# Altium schematic sheet switch.SchDoc
size A4
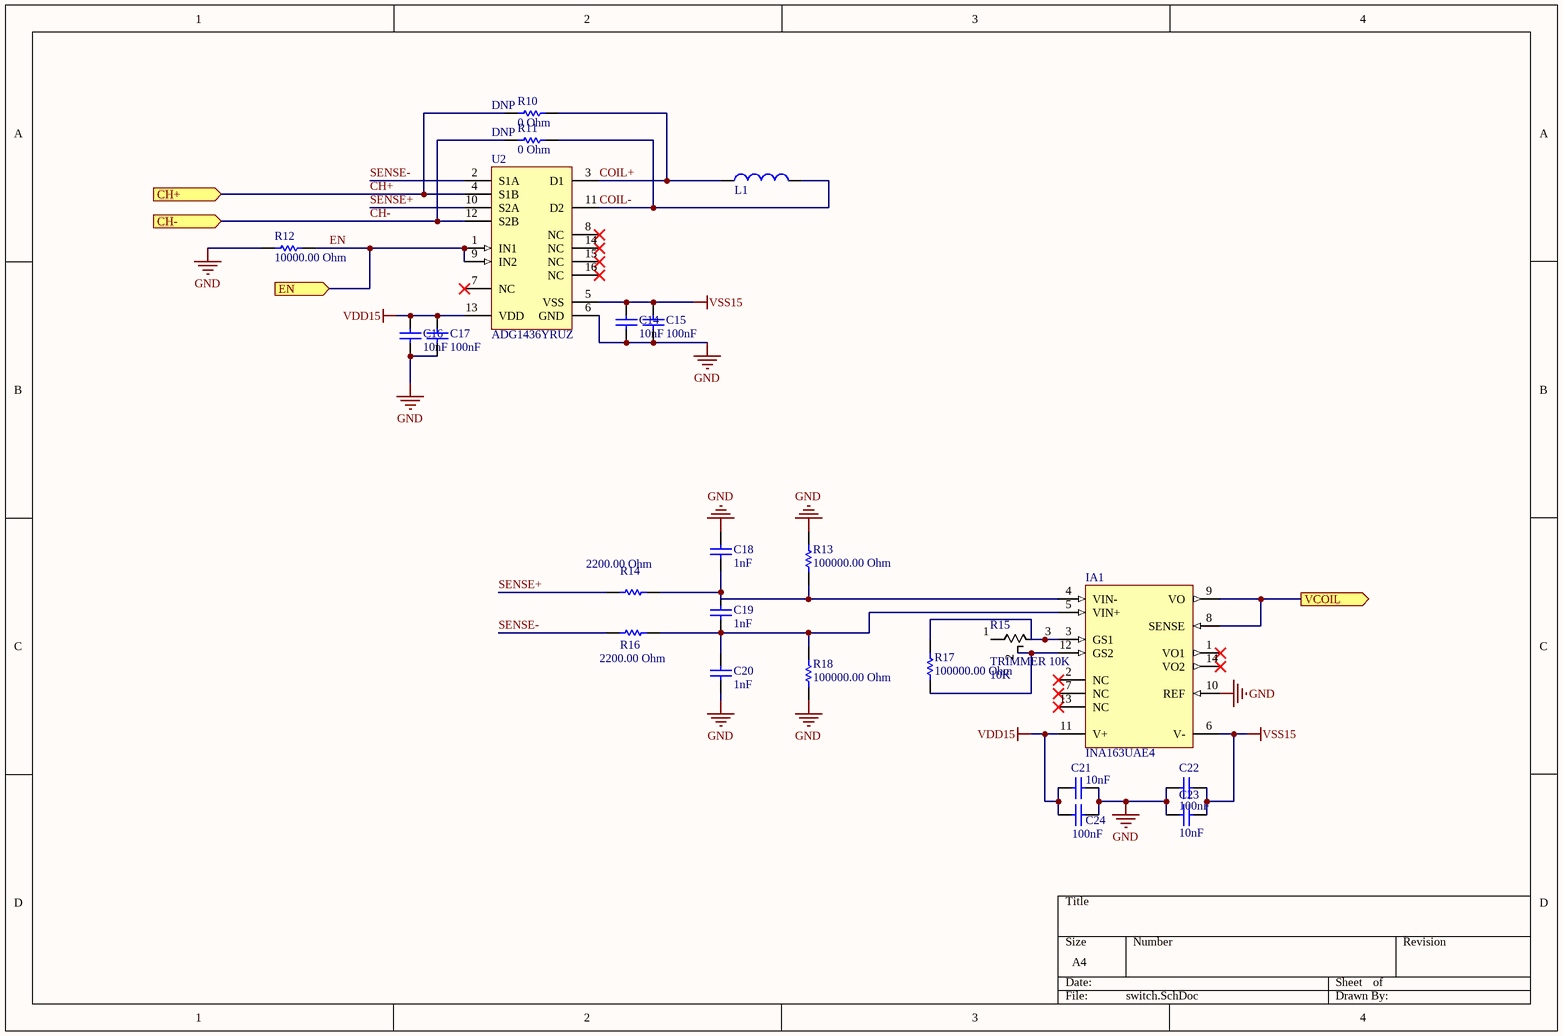
[diagram p0: switch.SchDoc]

## Parts
C14  value 10nF  [CAPC0603(1608)100_N]  (hidden comment: CAP 10nF 25V 0603(1608))
C15  value 100nF  [CAPC0603(1608)100_M]  (hidden comment: CAP 100nF 25V 0603(1608))
C16  value 10nF  [CAPC0603(1608)100_N]  (hidden comment: CAP 10nF 25V 0603(1608))
C17  value 100nF  [CAPC0603(1608)100_M]  (hidden comment: CAP 100nF 25V 0603(1608))
C18  value 1nF  [CAPC0603(1608)100_M]  (hidden comment: CAP 1nF 25V 0603(1608))
C19  value 1nF  [CAPC0603(1608)100_M]  (hidden comment: CAP 1nF 25V 0603(1608))
C20  value 1nF  [CAPC0603(1608)100_M]  (hidden comment: CAP 1nF 25V 0603(1608))
C21  value 10nF  [CAPC0603(1608)100_N]  (hidden comment: CAP 10nF 25V 0603(1608))
C22  value 100nF  [CAPC0603(1608)100_M]  (hidden comment: CAP 100nF 25V 0603(1608))
C23  value 10nF  [CAPC0603(1608)100_N]  (hidden comment: CAP 10nF 25V 0603(1608))
C24  value 100nF  [CAPC0603(1608)100_M]  (hidden comment: CAP 100nF 25V 0603(1608))
IA1  INA163UAE4  [TI-D14_M]
L1  (no value)  [TRANSMITTER_COIL_UCC_ORIGINAL]
R10  value 0 Ohm  [RESC0603(1608)_L]  (hidden comment: 1K 5% 0603(1608))
R11  value 0 Ohm  [RESC0603(1608)_L]  (hidden comment: 1K 5% 0603(1608))
R12  value 10000.00 Ohm  [RESC0603(1608)_L]  (hidden comment: 1K 5% 0603(1608))
R13  value 100000.00 Ohm  [RESC0603(1608)_N]  (hidden comment: 100K 5% 0603(1608))
R14  value 2200.00 Ohm  [RESC0603(1608)_L]  (hidden comment: 2K2 1% 0603(1608))
R15  TRIMMER 10K  value 10K  [TRIMMER 10K]
R16  value 2200.00 Ohm  [RESC0603(1608)_L]  (hidden comment: 2K2 1% 0603(1608))
R17  value 100000.00 Ohm  [RESC0603(1608)_N]  (hidden comment: 100K 5% 0603(1608))
R18  value 100000.00 Ohm  [RESC0603(1608)_N]  (hidden comment: 100K 5% 0603(1608))
U2  ADG1436YRUZ  [ADI-RU-16_L]

## Ports
CH+ (in), CH- (in), EN (in), VCOIL (out)

## Nets
GND: C14.1 C15.2 C16.1 C17.2 C18.2 C20.1 C21.2 C22.1 C23.2 C24.1 IA1.10(REF) R12.1 R13.1 R18.2 U2.6(GND)
VDD15: C16.2 C17.1 C21.1 C24.2 IA1.11(V+) U2.13(VDD)
VSS15: C14.2 C15.1 C22.2 C23.1 IA1.6(V-) U2.5(VSS)
CH+: R10.1 U2.4(S1B) ; port CH+
CH-: R11.1 U2.12(S2B) ; port CH-
COIL+: L1.2 R10.2 U2.3(D1)
COIL-: L1.1 R11.2 U2.11(D2)
EN: R12.2 U2.1(IN1) U2.9(IN2) ; port EN
SENSE+: R14.2 U2.10(S2A)
SENSE-: R16.2 U2.2(S1A)
VCOIL: IA1.8(SENSE) IA1.9(VO) ; port VCOIL
NetC18_1: C18.1 C19.2 IA1.4(VIN-) R13.2 R14.1
NetC19_1: C19.1 C20.2 IA1.5(VIN+) R16.1 R18.1
NetIA1_3: IA1.3(GS1) R15.3 R17.1
NetIA1_12: IA1.12(GS2) R15.2 R17.2

Not connected (* = marked no-connect by the designer): IA1 1(VO1)* 2(NC)* 7(NC)* 13(NC)* 14(VO2)*; R15 1; U2 7(NC)* 8(NC)* 14(NC)* 15(NC)* 16(NC)*

## Library data of the parts
C14 C16 C21 C23 = CMP-1035-02317-1: CAP 10nF 25V ±10% 0603 (1608 Metric) Thickness 1mm SMD; Tolerance: Â±10%; Case-Metric: 1608; Case-EIA: 0603; Max Thickness: 1 mm; Rated Voltage: 25 V; Technology: SMT; OrderURL: http://www.digikey.ie/product-detail/en/yageo/CC0603KRX7R8BB103/311-1360-1-ND/2103144; Supplier 1: Digi-Key; Supplier Part Number: 311-1360-1-ND; Supplier Part Number 1: 311-1360-1-ND
C15 C17 C22 C24 = CMP-1035-02588-1: CAP 100nF 25V ±10% 0603 (1608 Metric) Thickness 1mm SMD; Case-Metric: 1608; Case-EIA: 0603; Tolerance: Â±10%; Max Thickness: 1 mm; Technology: SMT; Rated Voltage: 25 V; OrderURL: http://www.digikey.ie/product-detail/en/yageo/CC0603KRX7R8BB104/311-1341-1-ND/2103125; Supplier 1: Digi-Key; Supplier Part Number 1: 311-1341-1-ND
C18-C20 = CMP-1035-01883-1: CAP 1nF 25V ±5% 0603 (1608 Metric) Thickness 1mm SMD; Case-EIA: 0603; Tolerance: Â±5%; Case-Metric: 1608; Technology: SMT; Rated Voltage: 25 V; Max Thickness: 1 mm
IA1 = CMP-0944-00014-1: Low-Noise Low-Distortion Instrumentation Amplifier, -40 to 125 degC, 14-pin SOIC (D14), Green (RoHS & no Sb/Br); Manufacturer: Texas Instruments; Non-Linearity (+/-)(Max)(%): 0.0006; Input Offset (+/-)(Max)(uV): 250; Vs(Max)(V): 36; Quiescent Current (+/-)(Typ)(mA): 10; Noise at 1kHz(Typ)(nV/rt(Hz)): 1; CMRR(Min)(dB): 100; Gain(V/V): 1 to 10000; Vs(Min)(V): 9; Input Bias Current (+/-)(Max)(nA): 12000; SubFamily: Single Supply; Mounting Technology: Surface Mount; ComponentLink3Description: Package Specification; PartNumber: INA163UAE4; ComponentLink2Description: Datasheet; PackageVersion: 4040047-5/M, 06/2011; Code_JEDEC: MS-012; DatasheetVersion: SBOS177D; Eco-Plan: Green (RoHS & no Sb/Br); ComponentLink3URL: http://www.ti.com/lit/ml/mpds177g/mpds177g.pdf; PackageReference: D14; ComponentLink1URL: http://www.ti.com/; ComponentLink1Description: Manufacturer URL; PackageDescription: 14-Pin Plastic Small Outline, Body 8.65 x 3.9 mm, Pitch 1.27 mm; ComponentLink2URL: http://www.ti.com/general/docs/lit/getliterature.tsp?genericPartNumber=INA163&fileType=pdf
L1 = TRANSMITTER_COIL_UCC_ORIGINAL
R10-R12 = CMP-1012-00074-1: 1K 0.1W 5% 0603 (1608 Metric)  SMD; Case-EIA: 0603; Case-Metric: 1608; Technology: SMT; Tolerance: 5 %; Power: 0.1 W; OrderURL: http://www.digikey.ie/product-detail/en/yageo/RC0603JR-071KL/311-1.0KGRCT-ND/729624; Supplier 1: Digi-Key; Supplier Part Number 1: 311-1.0KGRCT-ND
  R10 R11: DNP: DNP
R13 R17 R18 = CMP-1012-00122-1: 100K 0.1W 5% 0603 (1608 Metric)  SMD; Case-EIA: 0603; Case-Metric: 1608; Tolerance: 5 %; Power: 0.1 W; Technology: SMT; OrderURL: http://www.digikey.ie/product-detail/en/yageo/RC0603JR-07100KL/311-100KGRCT-ND/729645; Supplier Part Number 1: 311-100KGRCT-ND; Supplier 1: Digi-Key
R14 R16 = CMP-1012-00546-1: 2K2 0.1W 1% 0603 (1608 Metric)  SMD; Case-EIA: 0603; Case-Metric: 1608; Tolerance: 1 %; Power: 0.1 W; Technology: SMT
R15 = TRIMMER 10K: TRIMMER 10K OHM 0.5W TH; Manufacturer: TE Connectivity Passive Product; Manufacturer Part Number: 1-1623849-0; Power (Watts): 0.5W, 1/2W; Tolerance: ±10%; Temperature Coefficient: ±100ppm/°C; Number of Turns: 25; Adjustment Type: Top Adjustment; Resistive Material: Cermet; Published: 8-Jun-2000; LatestRevisionDate: 29-May-2009; LatestRevisionNote: IPC-7351 Footprint Added.; PackageReference: J1-0603; Publisher: Altium Limited; PackageDescription: Chip Resistor; RoHS: RoHS Compliant; Category: Potentiometers, Variable Resistors; Packaging: Bulk; Part Status: Active; Resistance (Ohms): 10k; Mounting Type: Through Hole; Termination Style: PC Pins; Size / Dimension: Rectangular - 0.374" x 0.185" Face x 0.394" H (9.50mm x 4.70mm x 10.00mm); ComponentLink1URL: http://www.te.com/commerce/DocumentDelivery/DDEController?Action=srchrtrv&DocNm=1623849&DocType=Customer+Drawing&DocLang=English; ComponentLink1Description: http://www.te.com/commerce/DocumentDelivery/DDEController?Action=srchrtrv&DocNm=1623849&DocType=Customer+Drawing&DocLang=English; Supplier 1: Digi-Key; Supplier Part Number 1: A105870-ND; Stock 1: 5809; Pricing 1: 1=0.89, 10=0.786, 25=0.7076, 50=0.6816, 100=0.6554, 250=0.61608, 500=0.5243, 1000=0.48499, 5000=0.39848 (EUR)
U2 = CMP-0793-00124-1: +/-15 V / 12 V / +/-5 V, iCMOS, Dual SPDT Switch, 16-pin SOP (RU-16), Tube; Manufacturer: Analog Devices; Ron (ohms): 1.5; Max Analog Signal Range: Vss to Vdd; Bandwidth (Hz): 110M, 78M, 85M; ComponentLink3URL: http:/www.analog.com/static/imported-files/packages/36244347913743854010197452789RU16.pdf; PartNumber: ADG1436YRUZ; Code_JEDEC: MO-153AB; ComponentLink1Description: Manufacturer URL; ComponentLink2URL: http://www.analog.com/static/imported-files/data_sheets/ADG1436.pdf; ComponentLink3Description: Package Specification; Mounting Technology: Surface Mount; ComponentLink2Description: Datasheet; PackageDescription: 16-Pin Thin Shrink Small Outline Package, Body 5 x 4.4 mm, Pitch 0.65 mm; ComponentLink1URL: http://www.analog.com/en/index.html; PackageVersion: Nov-02; Packing: Tube; PackageReference: RU-16; DatasheetVersion: Rev. A